# Altium project Kit ELO_DEVMPDv1.PrjPcb
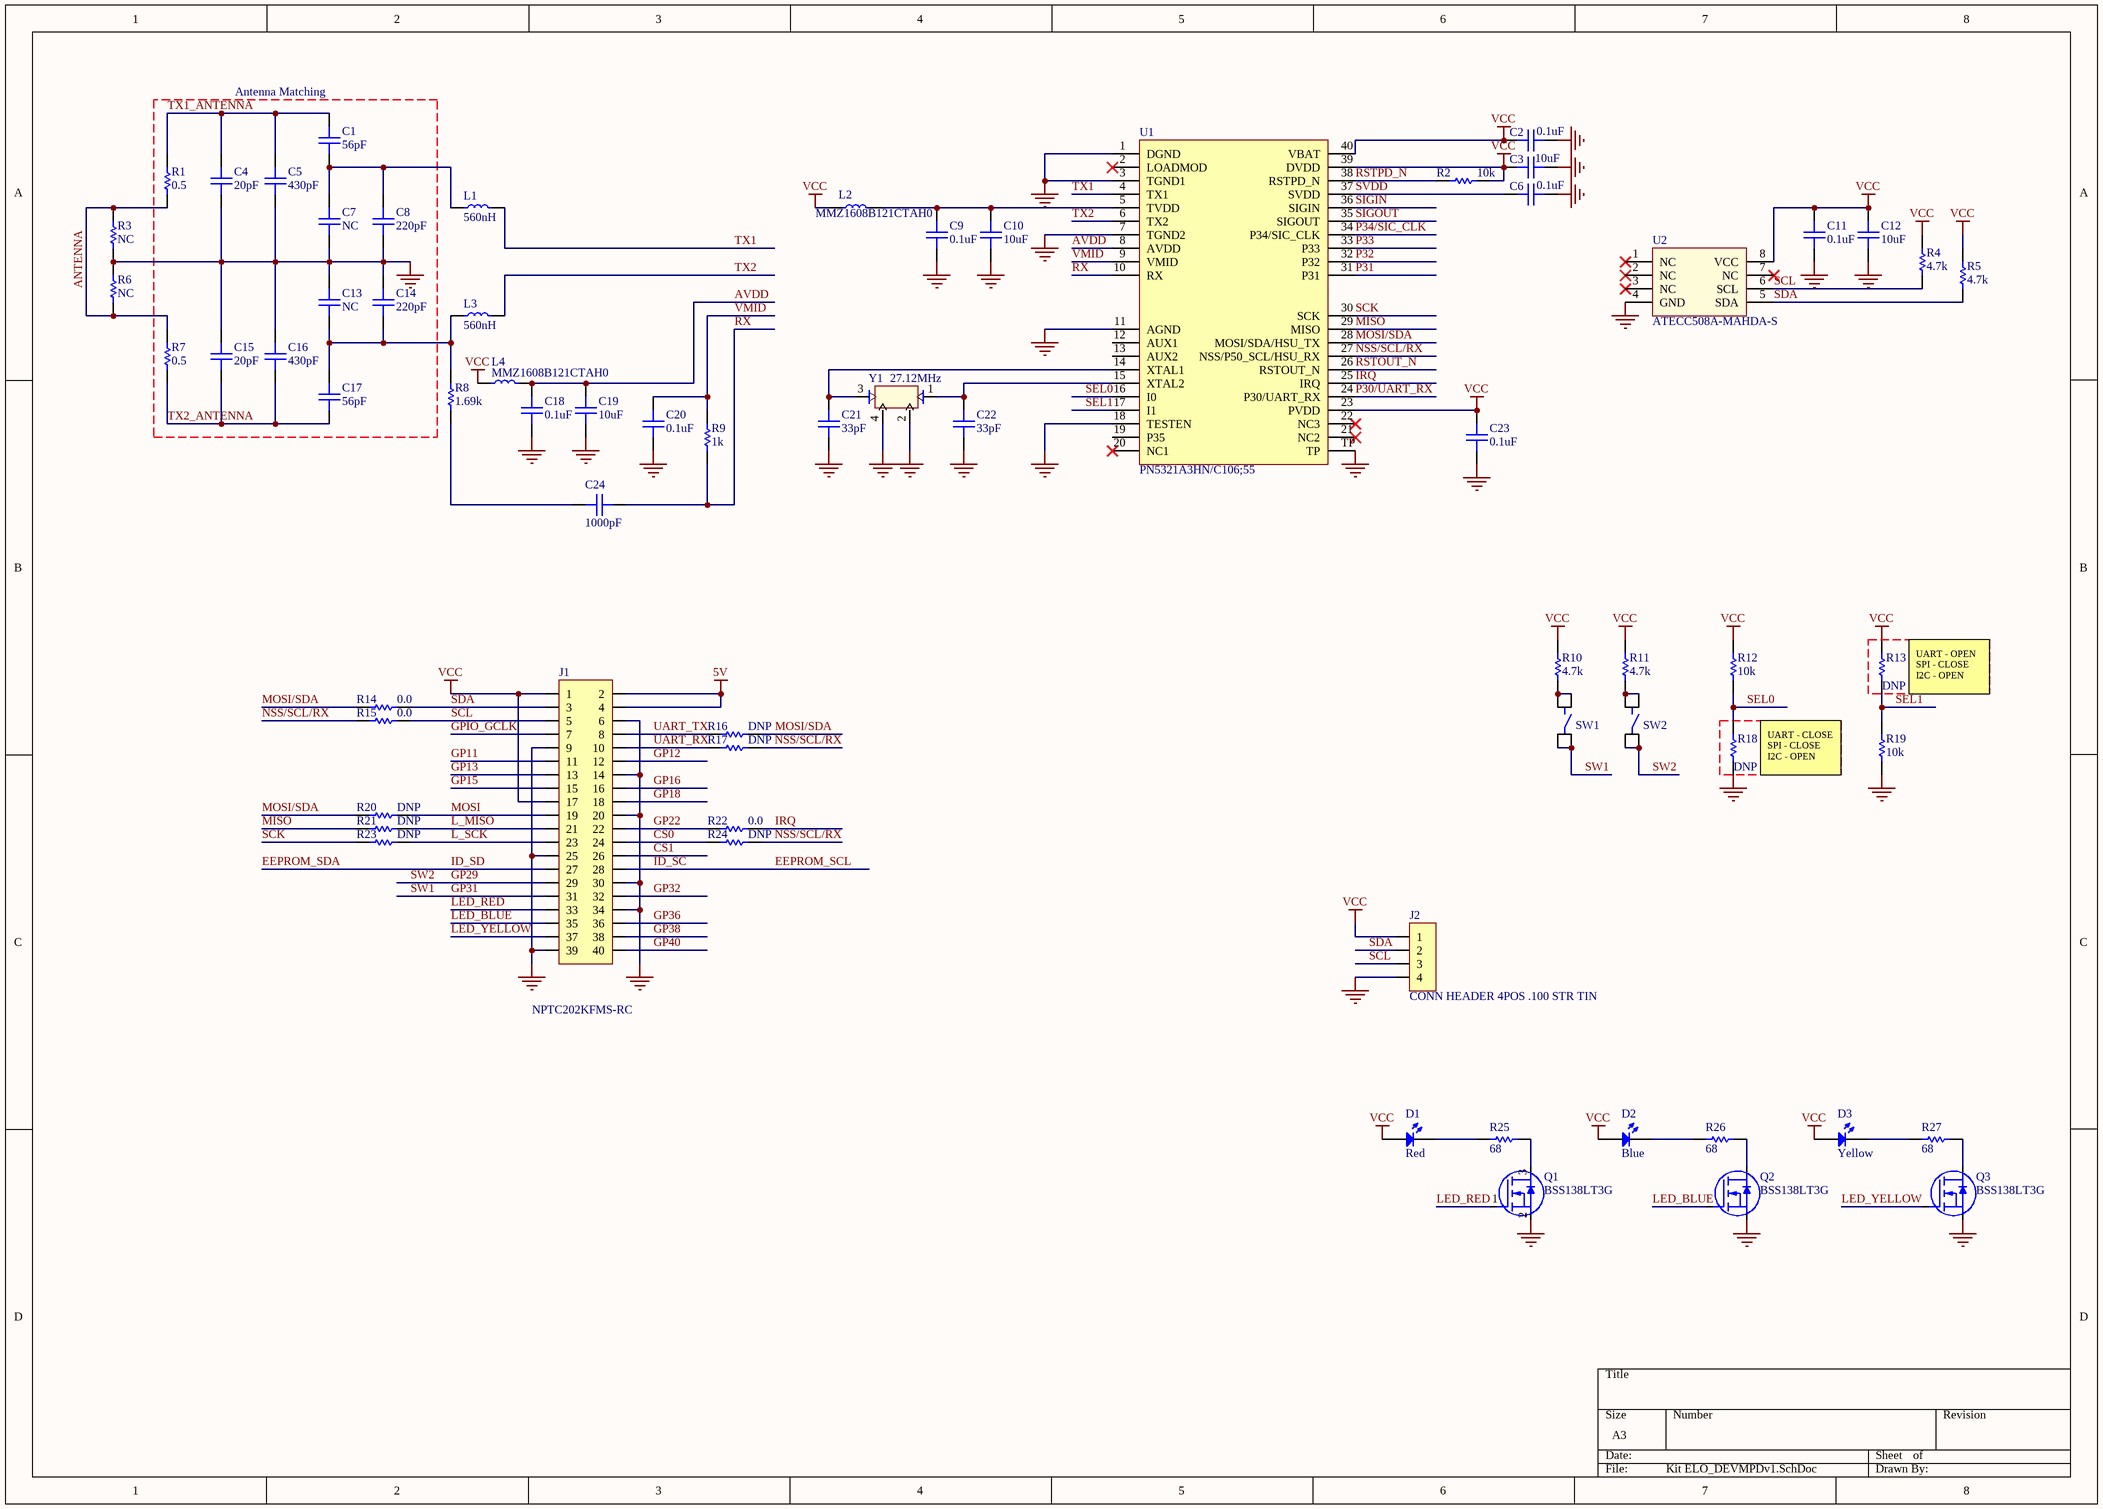
[diagram p0: Kit ELO_DEVMPDv1.SchDoc]
1 sheet, 68 parts. Net scope: global (net labels, ports and power ports of the same name join across sheets).
Board file: Kit ELO_DEVMPDv1.PcbDoc

## Sheet Kit ELO_DEVMPDv1.SchDoc: Kit ELO_DEVMPDv1
size A3; DrawnBy: Das Coisas

### Parts
C1  56pF  [STD 0402 REFLOW CAP]
C2  0.1uF  [STD 0402 REFLOW CAP]
C3  10uF  [STD 0603 REFLOW CAP]
C4  20pF  [STD 0402 REFLOW CAP]
C5  430pF  [STD 0402 REFLOW CAP]
C6  0.1uF  [STD 0402 REFLOW CAP]
C7  NC  [STD 0402 REFLOW CAP]
C8  220pF  [STD 0402 REFLOW CAP]
C9  0.1uF  [STD 0402 REFLOW CAP]
C10  10uF  [STD 0603 REFLOW CAP]
C11  0.1uF  [STD 0402 REFLOW CAP]
C12  10uF  [STD 0603 REFLOW CAP]
C13  NC  [STD 0402 REFLOW CAP]
C14  220pF  [STD 0402 REFLOW CAP]
C15  20pF  [STD 0402 REFLOW CAP]
C16  430pF  [STD 0402 REFLOW CAP]
C17  56pF  [STD 0402 REFLOW CAP]
C18  0.1uF  [STD 0402 REFLOW CAP]
C19  10uF  [STD 0603 REFLOW CAP]
C20  0.1uF  [STD 0402 REFLOW CAP]
C21  33pF  [STD 0603 REFLOW CAP]
C22  33pF  [STD 0603 REFLOW CAP]
C23  0.1uF  [STD 0402 REFLOW CAP]
C24  1000pF  [STD 0805 REFLOW CAP]
D1  Red  [STD 0603 REFLOW LED RED]
D2  Blue  [STD 0603 REFLOW LED BLUE]
D3  Yellow  [STD 0603 REFLOW LED YELLOW]
J1  NPTC202KFMS-RC  [CONNECTOR 2.54 20X2 POS]
J2  CONN HEADER 4POS .100 STR TIN  [.100 MILS / 1MM / 4POS]
L1  560nH  [STD 0805 REFLOW IND]
L2  MMZ1608B121CTAH0  [STD 0603 REFLOW IND]
L3  560nH  [STD 0805 REFLOW IND]
L4  MMZ1608B121CTAH0  [STD 0603 REFLOW IND]
Q1  BSS138LT3G  [TO-236-3, SC-59, SOT-23-3]
Q2  BSS138LT3G  [TO-236-3, SC-59, SOT-23-3]
Q3  BSS138LT3G  [TO-236-3, SC-59, SOT-23-3]
R1  0.5  [STD 0402 REFLOW RES]
R2  10k  [STD 0402 REFLOW RES]
R3  NC  [STD 0402 REFLOW RES]
R4  4.7k  [STD 0402 REFLOW RES]
R5  4.7k  [STD 0402 REFLOW RES]
R6  NC  [STD 0402 REFLOW RES]
R7  0.5  [STD 0402 REFLOW RES]
R8  1.69k  [STD 0402 REFLOW RES]
R9  1k  [STD 0402 REFLOW RES]
R10  4.7k  [STD 0402 REFLOW RES]
R11  4.7k  [STD 0402 REFLOW RES]
R12  10k  [STD 0402 REFLOW RES]
R13  DNP  [STD 0402 REFLOW RES]
R14  0.0  [STD 0402 REFLOW RES]
R15  0.0  [STD 0402 REFLOW RES]
R16  DNP  [STD 0402 REFLOW RES]
R17  DNP  [STD 0402 REFLOW RES]
R18  DNP  [STD 0402 REFLOW RES]
R19  10k  [STD 0402 REFLOW RES]
R20  DNP  [STD 0402 REFLOW RES]
R21  DNP  [STD 0402 REFLOW RES]
R22  0.0  [STD 0402 REFLOW RES]
R23  DNP  [STD 0402 REFLOW RES]
R24  DNP  [STD 0402 REFLOW RES]
R25  68  [STD 0402 REFLOW RES]
R26  68  [STD 0402 REFLOW RES]
R27  68  [STD 0402 REFLOW RES]
SW1  PTS645SL50SMTR92 LFS  [CK PTS645SM43SMTR92]  (value not drawn)
SW2  PTS645SL50SMTR92 LFS  [CK PTS645SM43SMTR92]  (value not drawn)
U1  PN5321A3HN/C106;55  [40-HVQFN (6x6)]
U2  ATECC508A-MAHDA-S  [8-UDFN (2x3)]
Y1  27.12MHz  [7M-27.120MEEQ-T]

### Blocks framed on the sheet
Antenna Matching: C1 C4 C5 C7 C8 C13-C17 R1 R7

### Nets
5V: J1.2 J1.4
GND: C2.1 C3.2 C4.1 C5.1 C6.1 C7.2 C8.1 C9.1 C10.1 C11.1 C12.2 C13.1 C14.2 C15.2 C16.2 C18.1 C19.1 C20.1 C21.1 C22.1 C23.1 J1.6 J1.9 J1.14 J1.20 J1.25 J1.30 J1.34 J1.39 J2.4 Q1.2(S) Q2.2(S) Q3.2(S) R3.1 R6.2 R18.1 R19.1 U1.1(DGND) U1.3(TGND1) U1.7(TGND2) U1.11(AGND) U1.18(TESTEN) U1.TP U2.4(GND) Y1.2 Y1.4
VCC: C2.2 C3.1 C11.2 C12.1 C23.2 D1.1(A) D2.1(A) D3.1(A) J1.1 J1.17 J2.1 L2.2 L4.2 R2.1 R4.2 R5.2 R10.2 R11.2 R12.2 R13.2 U1.23(PVDD) U1.39(DVDD) U1.40(VBAT) U2.8(VCC)
ANTENNA: R1.1 R3.2 R6.1 R7.1
AVDD: C18.2 C19.2 L4.1 U1.8(AVDD)
CS0: J1.24 R24.2
CS1: J1.26
EEPROM_SCL: J1.28  [also labelled ID_SC]
EEPROM_SDA: J1.27  [also labelled ID_SD]
GP11: J1.11
GP12: J1.12
GP13: J1.13
GP15: J1.15
GP16: J1.16
GP18: J1.18
GP22: J1.22 R22.2
GP29: J1.29 SW2.3 SW2.4  [also labelled SW2]
GP31: J1.31 SW1.3 SW1.4  [also labelled SW1]
GP32: J1.32
GP36: J1.36
GP38: J1.38
GP40: J1.40
GPIO_GCLK: J1.7
IRQ: R22.1 U1.25(IRQ)
L_MISO: J1.21 R21.2
L_SCK: J1.23 R23.2
LED_BLUE: J1.35 Q2.1(G)
LED_RED: J1.33 Q1.1(G)
LED_YELLOW: J1.37 Q3.1(G)
MISO: R21.1 U1.29(MISO)
MOSI: J1.19 R20.2
MOSI/SDA: R14.1 R16.1 R20.1 U1.28(MOSI/SDA/HSU_TX)
NSS/SCL/RX: R15.1 R17.1 R24.1 U1.27(NSS/P50_SCL/HSU_RX)
P30/UART_RX: U1.24(P30/UART_RX)
P31: U1.31(P31)
P32: U1.32(P32)
P33: U1.33(P33)
P34/SIC_CLK: U1.34(P34/SIC_CLK)
RSTOUT_N: U1.26(RSTOUT_N)
RSTPD_N: R2.2 U1.38(RSTPD_N)
RX: C24.1 R9.1 U1.10(RX)
SCK: R23.1 U1.30(SCK)
SCL: J1.5 J2.3 R4.1 R15.2 U2.6(SCL)
SDA: J1.3 J2.2 R5.1 R14.2 U2.5(SDA)
SEL0: R12.1 R18.2 U1.16(I0)
SEL1: R13.1 R19.2 U1.17(I1)
SIGIN: U1.36(SIGIN)
SIGOUT: U1.35(SIGOUT)
SVDD: C6.2 U1.37(SVDD)
TX1: L1.1 U1.4(TX1)
TX1_ANTENNA: C1.2 C4.2 C5.2 R1.2
TX2: L3.1 U1.6(TX2)
TX2_ANTENNA: C15.1 C16.1 C17.1 R7.2
UART_RX: J1.10 R17.2
UART_TX: J1.8 R16.2
VMID: C20.2 R9.2 U1.9(VMID)
NetC1_1: C1.1 C7.1 C8.2 L1.2
NetC9_2: C9.2 C10.2 L2.1 U1.5(TVDD)
NetC13_2: C13.2 C14.1 C17.2 L3.2 R8.2
NetC21_2: C21.2 U1.14(XTAL1) Y1.3
NetC22_2: C22.2 U1.15(XTAL2) Y1.1
NetC24_2: C24.2 R8.1
NetD1_2: D1.2(K) R25.1
NetD2_2: D2.2(K) R26.1
NetD3_2: D3.2(K) R27.1
NetQ1_3: Q1.3(D) R25.2
NetQ2_3: Q2.3(D) R26.2
NetQ3_3: Q3.3(D) R27.2
NetR10_1: R10.1 SW1.1 SW1.2
NetR11_1: R11.1 SW2.1 SW2.2

Not connected (* = marked no-connect by the designer): U1 2(LOADMOD)* 12(AUX1) 13(AUX2) 19(P35) 20(NC1)* 21(NC2)* 22(NC3)*; U2 1(NC)* 2(NC)* 3(NC)* 7(NC)*

### Notes on the sheet
- (near R13) UART - OPEN
  SPI - CLOSE
  I2C - OPEN
- UART - CLOSE
  SPI - CLOSE
  I2C - OPEN

### Library data of the parts
C1 C17 = CAP CER 56PF 50V C0G/NP0 0402: Manufacturer: Vishay Vitramon; Manufacturer Part Number: VJ0402D560JXAAJ; Tolerance: ±5%; Temperature Coefficient: C0G, NP0; Supplier 1: Digi-Key; RoHS: RoHS Compliant; Category: Capacitors; Stock 1: 7000; Pricing 1: 1000=0.14618, 2000=0.13758 (USD); Packaging: Tape & Reel (TR); Part Status: Active; Voltage - Rated: 50V; Operating Temperature: -55°C ~ 125°C; Features: High Q, Low Loss; Ratings: -; Applications: RF, Microwave, High Frequency; Mounting Type: Surface Mount, MLCC; Package / Case: 0402 (1005 Metric); Size / Dimension: 0.040" L x 0.020" W (1.02mm x 0.51mm); Height - Seated (Max): -; Thickness (Max): 0.024" (0.61mm); Lead Spacing: -; Lead Style: -; ComponentLink1URL: http://www.vishay.com/docs/45071/vjhifreq.pdf; ComponentLink1Description: http://www.vishay.com/docs/45071/vjhifreq.pdf; Supplier Part Number 1: 720-1293-2-ND; Capacitance: 56pF
C2 C6 C9 C11 C18 C20 C23 = CAP CER 0.1UF 10V X5R 0402: Manufacturer: Murata Electronics North America; Manufacturer Part Number: GRM155R61A104KA01D; Tolerance: ±10%; Supplier 1: Digi-Key; RoHS: RoHS Compliant; Category: Capacitors; Stock 1: 9840000; Pricing 1: 10000=0.00231, 20000=0.0022, 30000=0.00209 (USD); Packaging: Tape & Reel (TR); Part Status: Active; Voltage - Rated: 10V; Temperature Coefficient: X5R; Operating Temperature: -55°C ~ 85°C; Features: -; Ratings: -; Applications: General Purpose; Mounting Type: Surface Mount, MLCC; Package / Case: 0402 (1005 Metric); Size / Dimension: 0.039" L x 0.020" W (1.00mm x 0.50mm); Height - Seated (Max): -; Thickness (Max): 0.022" (0.55mm); Lead Spacing: -; Lead Style: -; ComponentLink1URL: http://www.murata.com/~/media/webrenewal/support/library/catalog/products/capacitor/mlcc/c02e.pdf; ComponentLink1Description: http://www.murata.com/~/media/webrenewal/support/library/catalog/products/capacitor/mlcc/c02e.pdf; Supplier Part Number 1: 490-1318-2-ND; Capacitance: 0.1uF
C3 C10 C12 C19 = CAP CER 10UF 16V X5R 0603: Manufacturer: Murata Electronics North America; Manufacturer Part Number: GRM188R61C106KAALD; Tolerance: ±10%; Supplier 1: Digi-Key; RoHS: RoHS Compliant; Category: Capacitors; Stock 1: 788000; Pricing 1: 4000=0.07854, 8000=0.07392, 12000=0.07161 (USD); Packaging: Tape & Reel (TR); Part Status: Active; Voltage - Rated: 16V; Temperature Coefficient: X5R; Operating Temperature: -55°C ~ 85°C; Features: -; Ratings: -; Applications: General Purpose; Mounting Type: Surface Mount, MLCC; Package / Case: 0603 (1608 Metric); Size / Dimension: 0.063" L x 0.032" W (1.60mm x 0.80mm); Height - Seated (Max): -; Thickness (Max): 0.037" (0.95mm); Lead Spacing: -; Lead Style: -; ComponentLink1URL: http://search.murata.co.jp/Ceramy/image/img/A01X/G101/ENG/GRM188R61C106KAAL-01.pdf; ComponentLink1Description: http://search.murata.co.jp/Ceramy/image/img/A01X/G101/ENG/GRM188R61C106KAAL-01.pdf; Supplier Part Number 1: 490-10728-2-ND; Capacitance: 10uF
C4 C15 = CAP CER 20PF 50V C0G/NP0 0402: Manufacturer: KEMET; Manufacturer Part Number: C0402C200J5GACTU; Tolerance: ±5%; Temperature Coefficient: C0G, NP0; Notification: Current market demand for these product types have resulted in fluctuating and extending lead times. Lead times may differ.; Supplier 1: Digi-Key; RoHS: RoHS Compliant; Category: Capacitors; Stock 1: 152554; Pricing 1: 1=0.33, 10=0.228, 100=0.129, 500=0.09108, 1000=0.0797, 2500=0.0759, 5000=0.07021 (USD); Packaging: Digi-Reel®; Part Status: Active; Voltage - Rated: 50V; Operating Temperature: -55°C ~ 125°C; Features: Low ESL; Ratings: -; Applications: General Purpose; Failure Rate: -; Mounting Type: Surface Mount, MLCC; Package / Case: 0402 (1005 Metric); Size / Dimension: 0.039" L x 0.020" W (1.00mm x 0.50mm); Height - Seated (Max): -; Thickness (Max): 0.022" (0.55mm); Lead Spacing: -; Lead Style: -; ComponentLink1URL: https://search.kemet.com/component-edge/download/datasheet/C0402C200J5GACTU.pdf; ComponentLink1Description: https://search.kemet.com/component-edge/download/datasheet/C0402C200J5GACTU.pdf; Supplier Part Number 1: 399-7773-6-ND; Capacitance: 20pF
C5 C16 = CAP CER 430PF 50V C0G/NP0 0402: Manufacturer: Murata Electronics North America; Manufacturer Part Number: GRM1555C1H431GA01D; Tolerance: ±2%; Temperature Coefficient: C0G, NP0; Notification: Current market demand for these product types have resulted in fluctuating and extending lead times. Lead times may differ.; Supplier 1: Digi-Key; RoHS: RoHS Compliant; Category: Capacitors; Stock 1: 10000; Pricing 1: 10000=0.02684, 20000=0.0255, 30000=0.02416 (USD); Packaging: Tape & Reel (TR); Part Status: Active; Voltage - Rated: 50V; Operating Temperature: -55°C ~ 125°C; Features: -; Ratings: -; Applications: General Purpose; Mounting Type: Surface Mount, MLCC; Package / Case: 0402 (1005 Metric); Size / Dimension: 0.039" L x 0.020" W (1.00mm x 0.50mm); Height - Seated (Max): -; Thickness (Max): 0.022" (0.55mm); Lead Spacing: -; Lead Style: -; ComponentLink1URL: https://www.murata.com/~/media/webrenewal/support/library/catalog/products/capacitor/mlcc/c02e.ashx?la=en-us; ComponentLink1Description: https://www.murata.com/~/media/webrenewal/support/library/catalog/products/capacitor/mlcc/c02e.ashx?la=en-us; Supplier Part Number 1: 490-6240-2-ND; Capacitance: 430pF
C7 C13 = CAP CER 0.1UF 10V X5R 0402: Manufacturer: Murata Electronics North America; Manufacturer Part Number: GRM155R61A104KA01D; Tolerance: ±10%; Voltage - Rated: 10V; Temperature Coefficient: X5R; Capacitance: 0.1uF; Supplier 1: Digi-Key; RoHS: RoHS Compliant; Category: Capacitors; Stock 1: 9840000; Pricing 1: 10000=0.00231, 20000=0.0022, 30000=0.00209 (USD); Packaging: Tape & Reel (TR); Part Status: Active; Operating Temperature: -55°C ~ 85°C; Features: -; Ratings: -; Applications: General Purpose; Mounting Type: Surface Mount, MLCC; Package / Case: 0402 (1005 Metric); Size / Dimension: 0.039" L x 0.020" W (1.00mm x 0.50mm); Height - Seated (Max): -; Thickness (Max): 0.022" (0.55mm); Lead Spacing: -; Lead Style: -; ComponentLink1URL: http://www.murata.com/~/media/webrenewal/support/library/catalog/products/capacitor/mlcc/c02e.pdf; ComponentLink1Description: http://www.murata.com/~/media/webrenewal/support/library/catalog/products/capacitor/mlcc/c02e.pdf; Supplier Part Number 1: 490-1318-2-ND
C8 C14 = CAP CER 220PF 50V C0G/NP0 0402: Manufacturer: Samsung Electro-Mechanics; Manufacturer Part Number: CL05C221JB5NNNC; Tolerance: ±5%; Temperature Coefficient: C0G, NP0; Supplier 1: Digi-Key; RoHS: RoHS Compliant; Category: Capacitors; Stock 1: 2140000; Pricing 1: 10000=0.00238, 20000=0.00227, 30000=0.00215 (USD); Packaging: Tape & Reel (TR); Part Status: Active; Voltage - Rated: 50V; Operating Temperature: -55°C ~ 125°C; Features: -; Ratings: -; Applications: General Purpose; Mounting Type: Surface Mount, MLCC; Package / Case: 0402 (1005 Metric); Size / Dimension: 0.039" L x 0.020" W (1.00mm x 0.50mm); Height - Seated (Max): -; Thickness (Max): 0.022" (0.55mm); Lead Spacing: -; Lead Style: -; ComponentLink1URL: http://media.digikey.com/pdf/Data%20Sheets/Samsung%20PDFs/CL_Series_MLCC_ds.pdf; ComponentLink1Description: http://media.digikey.com/pdf/Data%20Sheets/Samsung%20PDFs/CL_Series_MLCC_ds.pdf; Supplier Part Number 1: 1276-1059-2-ND; Capacitance: 220pF
C21 C22 = CAP CER 33PF 50V C0G/NP0 0603: Manufacturer: Murata Electronics North America; Manufacturer Part Number: GRM1885C1H330JA01D; Tolerance: ±5%; Temperature Coefficient: C0G, NP0; Supplier 1: Digi-Key; RoHS: RoHS Compliant; Category: Capacitors; Stock 1: 584000; Pricing 1: 4000=0.0129, 8000=0.01178, 12000=0.01122 (USD); Packaging: Tape & Reel (TR); Part Status: Active; Voltage - Rated: 50V; Operating Temperature: -55°C ~ 125°C; Features: -; Ratings: -; Applications: General Purpose; Mounting Type: Surface Mount, MLCC; Package / Case: 0603 (1608 Metric); Size / Dimension: 0.063" L x 0.032" W (1.60mm x 0.80mm); Height - Seated (Max): -; Thickness (Max): 0.035" (0.90mm); Lead Spacing: -; Lead Style: -; ComponentLink1URL: http://www.murata.com/~/media/webrenewal/support/library/catalog/products/capacitor/mlcc/c02e.pdf; ComponentLink1Description: http://www.murata.com/~/media/webrenewal/support/library/catalog/products/capacitor/mlcc/c02e.pdf; Supplier Part Number 1: 490-1415-2-ND; Capacitance: 33pF
C24 = CAP CER 1000PF 50V C0G/NP0 0805: Manufacturer: AVX Corporation; Manufacturer Part Number: 08055A102GAT2A; Tolerance: ±2%; Temperature Coefficient: C0G, NP0; Supplier 1: Digi-Key; RoHS: RoHS Compliant; Category: Capacitors; Stock 1: 12000; Pricing 1: 4000=0.1094, 8000=0.10296, 12000=0.09974 (USD); Packaging: Tape & Reel (TR); Part Status: Active; Voltage - Rated: 50V; Operating Temperature: -55°C ~ 125°C; Features: -; Ratings: -; Applications: General Purpose; Failure Rate: -; Mounting Type: Surface Mount, MLCC; Package / Case: 0805 (2012 Metric); Size / Dimension: 0.079" L x 0.049" W (2.01mm x 1.25mm); Height - Seated (Max): -; Thickness (Max): 0.037" (0.94mm); Lead Spacing: -; Lead Style: -; ComponentLink1URL: http://datasheets.avx.com/C0GNP0-Dielectric.pdf; ComponentLink1Description: http://datasheets.avx.com/C0GNP0-Dielectric.pdf; Supplier Part Number 1: 478-3760-2-ND; Capacitance: 1000pF
D1 = LED RED CLEAR 0603 SMD: Manufacturer: Lite-On Inc.; Manufacturer Part Number: LTST-C190EKT; Lens Color: Colorless; Millicandela Rating: 2mcd; Lens Style/Size: Rectangle with Flat Top, 1.10mm x 0.80mm; Voltage - Forward (Vf) (Typ): 2V; Current - Test: 10mA; Viewing Angle: 130°; Wavelength - Dominant: 621nm; Wavelength - Peak: 630nm; Supplier 1: Digi-Key; RoHS: RoHS Compliant; Category: Optoelectronics; Stock 1: 78000; Pricing 1: 3000=0.04646, 6000=0.0404, 15000=0.03636, 30000=0.03232, 75000=0.02929, 150000=0.02727 (USD); Packaging: Tape & Reel (TR); Part Status: Active; Color: Red; Lens Transparency: Clear; Mounting Type: Surface Mount; Features: -; Package / Case: 0603 (1608 Metric); Supplier Device Package: -; Size / Dimension: 1.60mm L x 0.80mm W; Height (Max): 0.80mm; ComponentLink1URL: http://media.digikey.com/pdf/Data%20Sheets/Lite-On%20PDFs/LTST-C190EKT.pdf; ComponentLink1Description: http://media.digikey.com/pdf/Data%20Sheets/Lite-On%20PDFs/LTST-C190EKT.pdf; Supplier Part Number 1: 160-1182-2-ND
D2 = LED BLUE CLEAR 0603 SMD: Manufacturer: Lite-On Inc.; Manufacturer Part Number: LTST-C193TBKT-5A; Lens Color: Colorless; Millicandela Rating: 15mcd; Lens Style/Size: Rectangle with Flat Top, 1.15mm x 0.80mm; Voltage - Forward (Vf) (Typ): 2.8V; Current - Test: 5mA; Viewing Angle: 130°; Wavelength - Dominant: 470nm; Wavelength - Peak: 468nm; Supplier 1: Digi-Key; RoHS: RoHS Compliant; Category: Optoelectronics; Stock 1: 705000; Pricing 1: 3000=0.0678, 6000=0.06102, 15000=0.05424, 30000=0.05085, 75000=0.04577, 150000=0.04407 (USD); Packaging: Tape & Reel (TR); Part Status: Active; Color: Blue; Lens Transparency: Clear; Mounting Type: Surface Mount; Features: -; Package / Case: 0603 (1608 Metric); Supplier Device Package: *; Size / Dimension: 1.60mm L x 0.80mm W; Height (Max): 0.35mm; ComponentLink1URL: http://optoelectronics.liteon.com/upload/download/DS22-2004-060/P_100_LTST-C193TBKT-5A.pdf; ComponentLink1Description: http://optoelectronics.liteon.com/upload/download/DS22-2004-060/P_100_LTST-C193TBKT-5A.pdf; Supplier Part Number 1: 160-1827-2-ND
D3 = LED YELLOW CLEAR 0603 SMD(LTST-C191KSKT): LED YELLOW CLEAR 0603 SMD; Manufacturer: Lite-On Inc.; Lens Color: Colorless; Millicandela Rating: 104mcd; Lens Style/Size: Rectangle with Flat Top, 1.10mm x 0.80mm; Voltage - Forward (Vf) (Typ): 2.1V; Current - Test: 20mA; Viewing Angle: 130°; Wavelength - Dominant: 591nm; Wavelength - Peak: 588nm; Supplier 1: Digi-Key; Manufacturer Part Number: LTST-C191KSKT; RoHS: RoHS Compliant; Category: Optoelectronics; Stock 1: 555000; Pricing 1: 5000=0.043, 10000=0.0387, 25000=0.0344, 50000=0.03118, 125000=0.02903 (USD); Packaging: Tape & Reel (TR); Part Status: Active; Color: Yellow; Lens Transparency: Clear; Mounting Type: Surface Mount; Features: -; Package / Case: 0603 (1608 Metric); Size / Dimension: 1.60mm L x 0.80mm W; Height (Max): 0.55mm; ComponentLink1URL: http://optoelectronics.liteon.com/upload/download/DS22-2000-224/S_110_LTST-C191KSKT.pdf; ComponentLink1Description: http://optoelectronics.liteon.com/upload/download/DS22-2000-224/S_110_LTST-C191KSKT.pdf; Supplier Part Number 1: 160-1448-2-ND
J1 = CONN FEMALE 40POS DL .1" TIN SMD: Manufacturer: Sullins Connector Solutions; Connector Type: Header; Style: Board to Board; Number of Positions: 40; Number of Positions Loaded: All; Pitch - Mating: 0.100" (2.54mm); Material Flammability Rating: UL94 V-0; Current Rating: 3A; Voltage Rating: 250V; Supplier 1: Digi-Key; Manufacturer Part Number: NPTC202KFMS-RC; RoHS: RoHS Compliant; Category: Connectors, Interconnects; Stock 1: 1633; Pricing 1: 1=3.52, 10=3.38, 100=2.817, 500=2.39446, 1000=2.04233 (USD); Packaging: Tube; Part Status: Active; Contact Type: Female Socket; Row Spacing - Mating: 0.100" (2.54mm); Mounting Type: Surface Mount; Termination: Solder; Fastening Type: Push-Pull; Contact Finish - Mating: Tin; Contact Finish Thickness - Mating: -; Insulation Color: Black; Insulation Height: 0.299" (7.60mm); Contact Length - Post: -; Operating Temperature: -40°C ~ 125°C; Contact Finish - Post: Tin; Mated Stacking Heights: -; Ingress Protection: -; Features: -; Applications: -; Insulation Material: Polyamide (PA6T), Nylon 6T; Contact Shape: Square; Contact Material: Phosphor Bronze; Contact Finish Thickness - Post: -; ComponentLink1URL: https://drawings-pdf.s3.amazonaws.com/10488.pdf; ComponentLink1Description: https://drawings-pdf.s3.amazonaws.com/10488.pdf; Supplier Part Number 1: S5690-ND
J2 = CONN HEADER 4POS .100 STR TIN: Manufacturer: Amphenol FCI; Manufacturer Part Number: 68002-404HLF; Connector Type: Header, Unshrouded; Number of Positions: 4; Number of Positions Loaded: All; Pitch: 0.100" (2.54mm); Supplier 1: Digi-Key; RoHS: RoHS Compliant; Category: Connectors, Interconnects; Stock 1: 3220; Pricing 1: 1=0.2, 10=0.186, 100=0.129, 500=0.10912, 1000=0.08928, 5000=0.07936, 10000=0.07192 (USD); Packaging: Bulk; Part Status: Active; Contact Type: Male Pin; Number of Rows: 1; Row Spacing: -; Contact Mating Length: 0.230" (5.84mm); Mounting Type: Through Hole; Termination: Solder; Fastening Type: -; Features: -; Contact Finish: Tin; Contact Finish Thickness: 100µin (2.54µm); Color: Black; ComponentLink1URL: http://portal.fciconnect.com/Comergent//fci/drawing/68000.pdf; ComponentLink1Description: http://portal.fciconnect.com/Comergent//fci/drawing/68000.pdf; Supplier Part Number 1: 609-3305-ND
L1 L3 = FIXED IND 560NH 240MA 3.1 OHM: Manufacturer: Pulse Electronics Network; Manufacturer Part Number: PE-0805CM561JTT; Type: Wirewound; Material - Core: Ceramic; Tolerance: ±5%; Shielding: Unshielded; DC Resistance (DCR): 3.1 Ohm Max; Q @ Freq: 40 @ 100MHz; Supplier 1: Digi-Key; RoHS: RoHS Compliant; Category: Inductors, Coils, Chokes; Stock 1: 2000; Pricing 1: 2000=0.144, 4000=0.136, 6000=0.128, 10000=0.124, 50000=0.116 (USD); Packaging: Tape & Reel (TR); Part Status: Active; Ratings: -; Operating Temperature: -40°C ~ 125°C; Mounting Type: Surface Mount; Package / Case: 0805 (2012 Metric); Supplier Device Package: 0805 (2012 Metric); Size / Dimension: 0.090" L x 0.066" W (2.29mm x 1.68mm); Height - Seated (Max): 0.062" (1.58mm); ComponentLink1URL: http://productfinder.pulseeng.com/products/datasheets/WC701.pdf; ComponentLink1Description: http://productfinder.pulseeng.com/products/datasheets/WC701.pdf; Supplier Part Number 1: 553-1047-2-ND; Inductance: 560nH
L2 L4 = FERRITE BEAD 120 OHM 0603 1LN: Manufacturer: TDK Corporation; Filter Type: Signal Line; Number of Lines: 1; Impedance @ Frequency: 120 Ohm @ 100MHz; Current Rating (Max): 600mA; DC Resistance (DCR) (Max): 150 mOhm; Supplier 1: Digi-Key; Manufacturer Part Number: MMZ1608B121CTAH0; RoHS: RoHS Compliant; Category: Filters; Stock 1: 100000; Pricing 1: 4000=0.0192, 8000=0.0174, 12000=0.0168, 28000=0.0156, 100000=0.01542 (USD); Packaging: Tape & Reel (TR); Part Status: Active; Ratings: -; Operating Temperature: -55°C ~ 125°C; Package / Case: 0603 (1608 Metric); Mounting Type: Surface Mount; Height (Max): 0.030" (0.75mm); Size / Dimension: 0.063" L x 0.032" W (1.60mm x 0.80mm); ComponentLink1URL: https://product.tdk.com/info/en/catalog/datasheets/beads_commercial_signal_mmz1608_en.pdf; ComponentLink1Description: https://product.tdk.com/info/en/catalog/datasheets/beads_commercial_signal_mmz1608_en.pdf; Supplier Part Number 1: 445-2164-2-ND
Q1-Q3 = MOSFET N-CH 50V 200MA SOT-23: Manufacturer: ON Semiconductor; FET Type: N-Channel; Current - Continuous Drain (Id) @ 25°C: 200mA (Ta); Drive Voltage (Max Rds On,  Min Rds On): 5V; Vgs(th) (Max) @ Id: 1.5V @ 1mA; Input Capacitance (Ciss) (Max) @ Vds: 50pF @ 25V; Vgs (Max): ±20V; Power Dissipation (Max): 225mW (Ta); Rds On (Max) @ Id, Vgs: 3.5 Ohm @ 200mA, 5V; Supplier 1: Digi-Key; Manufacturer Part Number: BSS138LT3G; RoHS: RoHS Compliant; Category: Discrete Semiconductor Products; Stock 1: 100000; Pricing 1: 10000=0.03273 (USD); Packaging: Tape & Reel (TR); Part Status: Active; Technology: MOSFET (Metal Oxide); Gate Charge (Qg) (Max) @ Vgs: -; FET Feature: -; Operating Temperature: -55°C ~ 150°C (TJ); Mounting Type: Surface Mount; Supplier Device Package: SOT-23-3 (TO-236); Package / Case: TO-236-3, SC-59, SOT-23-3; ComponentLink1URL: http://www.onsemi.com/pub/Collateral/BSS138LT1-D.PDF; ComponentLink1Description: http://www.onsemi.com/pub/Collateral/BSS138LT1-D.PDF; Supplier Part Number 1: BSS138LT3GOSTR-ND
R1 R7 = RES 0.5 OHM 1% 1/16W 0402: Manufacturer: Yageo; Manufacturer Part Number: RL0402FR-070R5L; Power (Watts): 0.063W, 1/16W; Temperature Coefficient: ±300ppm/°C; Supplier 1: Digi-Key; RoHS: RoHS Compliant; Category: Resistors; Stock 1: 30000; Pricing 1: 10000=0.0479, 30000=0.0455, 50000=0.04458, 100000=0.04362 (USD); Packaging: Tape & Reel (TR); Part Status: Active; Tolerance: ±1%; Composition: Thick Film; Features: Automotive AEC-Q200, Current Sense, Moisture Resistant; Operating Temperature: -55°C ~ 155°C; Package / Case: 0402 (1005 Metric); Supplier Device Package: 0402; Size / Dimension: 0.039" L x 0.020" W (1.00mm x 0.50mm); Height - Seated (Max): 0.016" (0.40mm); Failure Rate: -; ComponentLink1URL: http://www.yageo.com/documents/recent/PYu-RL_Group_521_RoHS_L_2.pdf; ComponentLink1Description: http://www.yageo.com/documents/recent/PYu-RL_Group_521_RoHS_L_2.pdf; Supplier Part Number 1: 311-.5PTR-ND; Resistance (Ohms): 0.5
R2 R12 R19 = RES SMD 10K OHM 1% 1/16W 0402: Manufacturer: Yageo; Manufacturer Part Number: RC0402FR-0710KL; Power (Watts): 0.063W, 1/16W; Temperature Coefficient: ±100ppm/°C; Supplier 1: Digi-Key; RoHS: RoHS Compliant; Category: Resistors; Stock 1: 11940000; Pricing 1: 10000=0.00158, 30000=0.00138, 50000=0.00127, 100000=0.00124 (USD); Packaging: Tape & Reel (TR); Part Status: Active; Tolerance: ±1%; Composition: Thick Film; Features: Moisture Resistant; Operating Temperature: -55°C ~ 155°C; Package / Case: 0402 (1005 Metric); Supplier Device Package: 0402; Size / Dimension: 0.039" L x 0.020" W (1.00mm x 0.50mm); Height - Seated (Max): 0.016" (0.40mm); Failure Rate: -; ComponentLink1URL: http://www.yageo.com/documents/recent/PYu-RC_Group_51_RoHS_L_7.pdf; ComponentLink1Description: http://www.yageo.com/documents/recent/PYu-RC_Group_51_RoHS_L_7.pdf; Supplier Part Number 1: 311-10.0KLRTR-ND; Resistence (Ohms): 10k
R3 R6 = RES SMD 10K OHM 1% 1/16W 0402: Manufacturer: Yageo; Manufacturer Part Number: RC0402FR-0710KL; Tolerance: ±1%; Power (Watts): 0.063W, 1/16W; Temperature Coefficient: ±100ppm/°C; Resistence (Ohms): 10k; Supplier 1: Digi-Key; RoHS: RoHS Compliant; Category: Resistors; Stock 1: 11940000; Pricing 1: 10000=0.00158, 30000=0.00138, 50000=0.00127, 100000=0.00124 (USD); Packaging: Tape & Reel (TR); Part Status: Active; Composition: Thick Film; Features: Moisture Resistant; Operating Temperature: -55°C ~ 155°C; Package / Case: 0402 (1005 Metric); Supplier Device Package: 0402; Size / Dimension: 0.039" L x 0.020" W (1.00mm x 0.50mm); Height - Seated (Max): 0.016" (0.40mm); Failure Rate: -; ComponentLink1URL: http://www.yageo.com/documents/recent/PYu-RC_Group_51_RoHS_L_7.pdf; ComponentLink1Description: http://www.yageo.com/documents/recent/PYu-RC_Group_51_RoHS_L_7.pdf; Supplier Part Number 1: 311-10.0KLRTR-ND
R4 R5 R10 R11 = RES SMD 4.7K OHM 5% 1/10W 0402: Manufacturer: Panasonic Electronic Components; Manufacturer Part Number: ERJ-2GEJ472X; Power (Watts): 0.1W, 1/10W; Temperature Coefficient: ±200ppm/°C; Supplier 1: Digi-Key; RoHS: RoHS Compliant; Category: Resistors; Stock 1: 8580000; Pricing 1: 10000=0.00198, 30000=0.00174, 50000=0.0016, 100000=0.00156 (USD); Packaging: Tape & Reel (TR); Part Status: Active; Resistance (Ohms): 4.7k; Composition: Thick Film; Features: Automotive AEC-Q200; Operating Temperature: -55°C ~ 155°C; Package / Case: 0402 (1005 Metric); Supplier Device Package: 0402; Size / Dimension: 0.039" L x 0.020" W (1.00mm x 0.50mm); Height - Seated (Max): 0.016" (0.40mm); Number of Terminations: 2; Failure Rate: -; ComponentLink1URL: http://industrial.panasonic.com/www-cgi/jvcr13pz.cgi?E+PZ+3+AOA0001+ERJ2GEJ472X+7+WW; ComponentLink1Description: http://industrial.panasonic.com/www-cgi/jvcr13pz.cgi?E+PZ+3+AOA0001+ERJ2GEJ472X+7+WW; Supplier Part Number 1: P4.7KJTR-ND; Tolerance: ±5%
R8 = RES SMD 1.69K OHM 1% 1/16W 0402: Manufacturer: Yageo; Manufacturer Part Number: RC0402FR-071K69L; Power (Watts): 0.063W, 1/16W; Temperature Coefficient: ±100ppm/°C; Supplier 1: Digi-Key; RoHS: RoHS Compliant; Category: Resistors; Stock 1: 310000; Pricing 1: 10000=0.0014, 30000=0.00123, 50000=0.00113, 100000=0.00111 (USD); Packaging: Tape & Reel (TR); Part Status: Active; Tolerance: ±1%; Composition: Thick Film; Features: Moisture Resistant; Operating Temperature: -55°C ~ 155°C; Package / Case: 0402 (1005 Metric); Supplier Device Package: 0402; Size / Dimension: 0.039" L x 0.020" W (1.00mm x 0.50mm); Height - Seated (Max): 0.016" (0.40mm); Failure Rate: -; ComponentLink1URL: http://www.yageo.com/documents/recent/PYu-RC_Group_51_RoHS_L_7.pdf; ComponentLink1Description: http://www.yageo.com/documents/recent/PYu-RC_Group_51_RoHS_L_7.pdf; Supplier Part Number 1: YAG3044TR-ND; Resistance (Ohms): 1.69k
R9 = RES SMD 1K OHM 5% 1/16W 0402: Manufacturer: Yageo; Manufacturer Part Number: RC0402JR-071KL; Power (Watts): 0.063W, 1/16W; Temperature Coefficient: ±100ppm/°C; Supplier 1: Digi-Key; RoHS: RoHS Compliant; Category: Resistors; Stock 1: 2860000; Pricing 1: 10000=0.00121, 30000=0.00106, 50000=0.00097, 100000=0.00095 (USD); Packaging: Tape & Reel (TR); Part Status: Active; Resistance (Ohms): 1k; Tolerance: ±5%; Composition: Thick Film; Features: Moisture Resistant; Operating Temperature: -55°C ~ 155°C; Package / Case: 0402 (1005 Metric); Supplier Device Package: 0402; Size / Dimension: 0.039" L x 0.020" W (1.00mm x 0.50mm); Height - Seated (Max): 0.016" (0.40mm); Failure Rate: -; ComponentLink1URL: http://www.yageo.com/documents/recent/PYu-RC_Group_51_RoHS_L_6.pdf; ComponentLink1Description: http://www.yageo.com/documents/recent/PYu-RC_Group_51_RoHS_L_6.pdf; Supplier Part Number 1: 311-1.0KJRTR-ND
R13 R16-R18 R20 R21 R23 R24 = RES SMD 0.0OHM JUMPER 1/16W 0402: Manufacturer: Rohm Semiconductor; Manufacturer Part Number: MCR01MZPJ000; Resistance (Ohms): 0.0; Power (Watts): 0.063W, 1/16W; Supplier 1: Digi-Key; RoHS: RoHS Compliant; Category: Resistors; Stock 1: 0; Pricing 1: 10000=0.00198, 30000=0.00174, 50000=0.0016, 100000=0.00156 (USD); Packaging: Tape & Reel (TR); Part Status: Active; Tolerance: Jumper; Composition: Thick Film; Features: Automotive AEC-Q200; Temperature Coefficient: -; Operating Temperature: -55°C ~ 155°C; Package / Case: 0402 (1005 Metric); Supplier Device Package: 0402; Size / Dimension: 0.039" L x 0.020" W (1.00mm x 0.50mm); Height - Seated (Max): 0.016" (0.40mm); Number of Terminations: 2; Failure Rate: -; ComponentLink1URL: http://rohmfs.rohm.com/en/products/databook/datasheet/passive/resistor/chip_resistor/mcr.pdf; ComponentLink1Description: http://rohmfs.rohm.com/en/products/databook/datasheet/passive/resistor/chip_resistor/mcr.pdf; Supplier Part Number 1: RHM0.0JTR-ND
R14 R15 R22 = RES SMD 0.0OHM JUMPER 1/16W 0402: Manufacturer: Rohm Semiconductor; Manufacturer Part Number: MCR01MZPJ000; Power (Watts): 0.063W, 1/16W; Supplier 1: Digi-Key; RoHS: RoHS Compliant; Category: Resistors; Stock 1: 0; Pricing 1: 10000=0.00198, 30000=0.00174, 50000=0.0016, 100000=0.00156 (USD); Packaging: Tape & Reel (TR); Part Status: Active; Resistance (Ohms): 0.0; Tolerance: Jumper; Composition: Thick Film; Features: Automotive AEC-Q200; Temperature Coefficient: -; Operating Temperature: -55°C ~ 155°C; Package / Case: 0402 (1005 Metric); Supplier Device Package: 0402; Size / Dimension: 0.039" L x 0.020" W (1.00mm x 0.50mm); Height - Seated (Max): 0.016" (0.40mm); Number of Terminations: 2; Failure Rate: -; ComponentLink1URL: http://rohmfs.rohm.com/en/products/databook/datasheet/passive/resistor/chip_resistor/mcr.pdf; ComponentLink1Description: http://rohmfs.rohm.com/en/products/databook/datasheet/passive/resistor/chip_resistor/mcr.pdf; Supplier Part Number 1: RHM0.0JTR-ND
R25-R27 = RES SMD 68 OHM 5% 1/10W 0402: Manufacturer: Panasonic Electronic Components; Manufacturer Part Number: ERJ-2GEJ680X; Power (Watts): 0.1W, 1/10W; Temperature Coefficient: ±200ppm/°C; Supplier 1: Digi-Key; RoHS: RoHS Compliant; Category: Resistors; Stock 1: 20000; Pricing 1: 10000=0.00204, 30000=0.00179, 50000=0.00164, 100000=0.00163 (USD); Packaging: Tape & Reel (TR); Part Status: Active; Resistance (Ohms): 68; Tolerance: ±5%; Composition: Thick Film; Features: Automotive AEC-Q200; Operating Temperature: -55°C ~ 155°C; Package / Case: 0402 (1005 Metric); Supplier Device Package: 0402; Size / Dimension: 0.039" L x 0.020" W (1.00mm x 0.50mm); Height - Seated (Max): 0.016" (0.40mm); Failure Rate: -; ComponentLink1URL: http://industrial.panasonic.com/www-cgi/jvcr13pz.cgi?E+PZ+3+AOA0001+ERJ2GEJ680X+7+WW; ComponentLink1Description: http://industrial.panasonic.com/www-cgi/jvcr13pz.cgi?E+PZ+3+AOA0001+ERJ2GEJ680X+7+WW; Supplier Part Number 1: P68JTR-ND
SW1 SW2 = SWITCH TACTILE SPST-NO 0.05A 12V (BLACK): SWITCH TACTILE SPST-NO 0.05A 12V; Manufacturer: C&K; Switch Function: Off-Mom; Contact Rating @ Voltage: 0.05A @ 12VDC; Actuator Type: Standard; Actuator Height off PCB, Vertical: 5.00mm; Actuator Orientation: Top Actuated; Outline: 6.00mm x 6.00mm; Illumination: Non-Illuminated; Operating Force: 130gf; Actuator Material: Polyamide (PA66), Nylon 6/6; Mechanical Life: 100,000 Cycles; Supplier 1: Digi-Key; Manufacturer Part Number: PTS645SL50SMTR92 LFS; RoHS: RoHS Compliant; Category: Switches; Stock 1: 39000; Pricing 1: 1000=0.14044, 5000=0.11636 (USD); Packaging: Tape & Reel (TR); Part Status: Active; Circuit: SPST-NO; Mounting Type: Surface Mount; Actuator Length, Right Angle: -; Termination Style: Gull Wing; Illumination Type, Color: -; Illumination Voltage (Nominal): -; Ingress Protection: -; Features: -; Switch Travel: -; Operating Temperature: -20°C ~ 60°C; ComponentLink1URL: http://www.ckswitches.com/media/1471/pts645.pdf; ComponentLink1Description: http://www.ckswitches.com/media/1471/pts645.pdf; Supplier Part Number 1: CKN9088TR-ND
U1 = PN5321A3HN/C106;55: IC NFC NEAR FIELD CTLR 40HVQFN; Manufacturer: NXP USA Inc.; Frequency: 13.56MHz; Standards: FeliCa, ISO 14443, MIFARE, NFC; Interface: I²C, SPI, UART; Supplier 1: Digi-Key; Manufacturer Part Number: PN5321A3HN/C106;55; RoHS: RoHS Compliant; Category: RF/IF and RFID; Stock 1: 935; Pricing 1: 1=11.48, 10=10.522, 25=9.5652, 100=8.6088, 250=7.89144, 500=7.17404, 1000=6.45663 (USD); Packaging: Tray; Part Status: Active; Type: RFID Reader/Transponder; Operating Temperature: -30°C ~ 85°C; Package / Case: 40-VFQFN Exposed Pad; Supplier Device Package: 40-HVQFN (6x6); ComponentLink1URL: http://www.nxp.com/documents/short_data_sheet/PN532_C1_SDS.pdf; ComponentLink1Description: http://www.nxp.com/documents/short_data_sheet/PN532_C1_SDS.pdf; Supplier Part Number 1: 568-8600-ND
U2 = ATECC508A-MAHDA-S (2): AUTHENTICATION CHIP I2C 8-UDFN; Manufacturer: Microchip Technology; Supplier 1: Digi-Key; Manufacturer Part Number: ATECC508A-MAHDA-S; RoHS: RoHS Compliant; Category: Integrated Circuits (ICs); Stock 1: 48000; Pricing 1: 3000=0.69825 (USD); Packaging: Tape & Reel (TR); Part Status: Active; Type: Authentication Chip; Applications: Networking and Communications; Mounting Type: Surface Mount; Package / Case: 8-UFDFN Exposed Pad; Supplier Device Package: 8-UDFN (2x3); ComponentLink1URL: http://www.microchip.com/mymicrochip/filehandler.aspx?ddocname=en590686; ComponentLink1Description: http://www.microchip.com/mymicrochip/filehandler.aspx?ddocname=en590686; Supplier Part Number 1: ATECC508A-MAHDA-STR-ND
Y1 = CRYSTAL 27.1200MHZ 10PF SMD: Manufacturer: TXC CORPORATION; Frequency Stability: ±10ppm; ESR (Equivalent Series Resistance): 60 Ohm; Operating Mode: Fundamental; Supplier 1: Digi-Key; Manufacturer Part Number: 7M-27.120MEEQ-T; RoHS: RoHS Compliant; Category: Crystals, Oscillators, Resonators; Stock 1: 31663; Pricing 1: 1=1.29, 10=1.139, 50=1.0642, 100=0.9405, 500=0.891, 1000=0.7425 (USD); Packaging: Cut Tape (CT); Part Status: Active; Type: MHz Crystal; Frequency: 27.12MHz; Frequency Tolerance: ±10ppm; Load Capacitance: 10pF; Operating Temperature: -20°C ~ 70°C; Ratings: -; Mounting Type: Surface Mount; Package / Case: 4-SMD, No Lead; Size / Dimension: 0.126" L x 0.098" W (3.20mm x 2.50mm); Height - Seated (Max): 0.032" (0.80mm); ComponentLink1URL: http://www.txccrystal.com/images/pdf/7m-accuracy.pdf; ComponentLink1Description: http://www.txccrystal.com/images/pdf/7m-accuracy.pdf; Supplier Part Number 1: 887-1329-1-ND